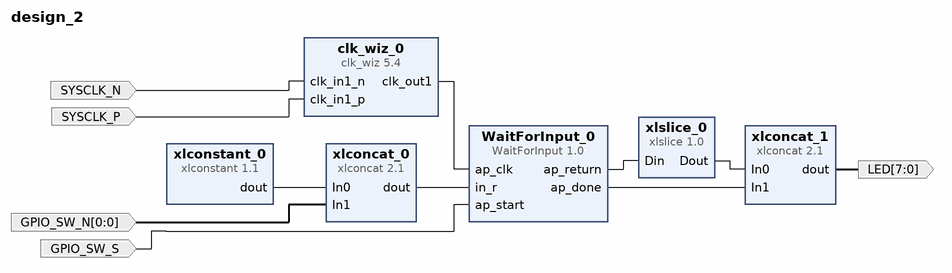
[diagram p0: block diagram of the top level]
# Vivado block design design_2, xc7vx485tffg1761-2, Vivado 2017.2
create_bd_design design_2

create_bd_port -dir I -type clk SYSCLK_N
create_bd_port -dir I -type clk SYSCLK_P
create_bd_port -dir I GPIO_SW_S
create_bd_port -dir O -from 7 -to 0 -type data LED
create_bd_port -dir I -from 0 -to 0 GPIO_SW_N

create_bd_cell -type ip -vlnv xilinx.com:ip:clk_wiz:5.4 clk_wiz_0
set_property -dict [list \
  CONFIG.CLKIN1_JITTER_PS 50.0 \
  CONFIG.CLKOUT1_REQUESTED_OUT_FREQ 200 \
  CONFIG.PRIM_SOURCE Differential_clock_capable_pin \
  CONFIG.MMCM_DIVCLK_DIVIDE 1 \
  CONFIG.MMCM_CLKFBOUT_MULT_F 5.000 \
  CONFIG.MMCM_CLKIN1_PERIOD 5.000 \
  CONFIG.MMCM_CLKIN2_PERIOD 10.0 \
  CONFIG.MMCM_CLKOUT0_DIVIDE_F 5.000 \
  CONFIG.USE_BOARD_FLOW true \
  CONFIG.CLK_IN1_BOARD_INTERFACE sys_diff_clock \
  CONFIG.RESET_BOARD_INTERFACE reset \
  CONFIG.CLKOUT1_JITTER 98.146 \
  CONFIG.CLKOUT1_PHASE_ERROR 89.971 \
] [get_bd_cells clk_wiz_0]
create_bd_cell -type ip -vlnv xilinx.com:ip:xlconstant:1.1 xlconstant_0
set_property -dict {CONFIG.CONST_WIDTH 7 CONFIG.CONST_VAL 000000} [get_bd_cells xlconstant_0]
create_bd_cell -type ip -vlnv xilinx.com:ip:xlconcat:2.1 xlconcat_0
set_property -dict {CONFIG.IN0_WIDTH 7} [get_bd_cells xlconcat_0]
create_bd_cell -type ip -vlnv Suitcase:hls:WaitForInput:1.0 WaitForInput_0
create_bd_cell -type ip -vlnv xilinx.com:ip:xlslice:1.0 xlslice_0
set_property -dict {CONFIG.DIN_TO 0 CONFIG.DIN_FROM 6 CONFIG.DIN_WIDTH 8 CONFIG.DOUT_WIDTH 7} [get_bd_cells xlslice_0]
create_bd_cell -type ip -vlnv xilinx.com:ip:xlconcat:2.1 xlconcat_1
set_property -dict {CONFIG.IN0_WIDTH 7} [get_bd_cells xlconcat_1]

# ---- connections ----

connect_bd_net [get_bd_ports SYSCLK_N] [get_bd_pins clk_wiz_0/clk_in1_n]
connect_bd_net [get_bd_ports SYSCLK_P] [get_bd_pins clk_wiz_0/clk_in1_p]
connect_bd_net [get_bd_pins xlconstant_0/dout] [get_bd_pins xlconcat_0/In0]
connect_bd_net -net In1_1 [get_bd_ports GPIO_SW_N] [get_bd_pins xlconcat_0/In1]
connect_bd_net [get_bd_pins xlconcat_0/dout] [get_bd_pins WaitForInput_0/in_r]
connect_bd_net [get_bd_pins clk_wiz_0/clk_out1] [get_bd_pins WaitForInput_0/ap_clk]
connect_bd_net [get_bd_ports GPIO_SW_S] [get_bd_pins WaitForInput_0/ap_start]
connect_bd_net [get_bd_pins WaitForInput_0/ap_return] [get_bd_pins xlslice_0/Din]
connect_bd_net [get_bd_pins xlslice_0/Dout] [get_bd_pins xlconcat_1/In0]
connect_bd_net [get_bd_pins WaitForInput_0/ap_done] [get_bd_pins xlconcat_1/In1]
connect_bd_net [get_bd_pins xlconcat_1/dout] [get_bd_ports LED]

validate_bd_design
save_bd_design
